# Altium schematic sheet CPU.SchDoc
size A
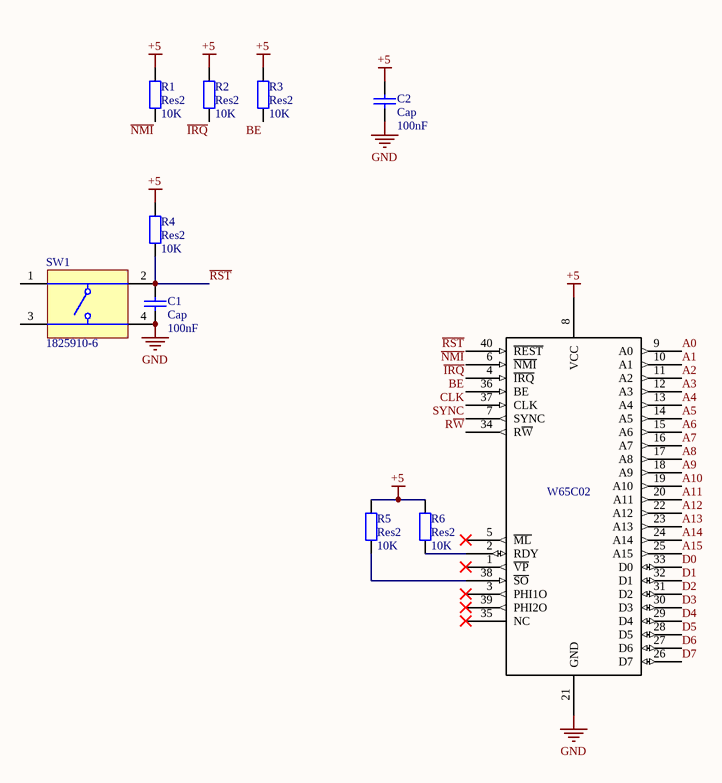
[diagram p0: CPU.SchDoc]

## Parts
?  W65C02  [DIP40]
C1  Cap  value 100nF  [Ceramic Capacitor]
C2  Cap  value 100nF  [Ceramic Capacitor]
R1  Res2  value 10K  [AXIAL-0.4]
R2  Res2  value 10K  [AXIAL-0.4]
R3  Res2  value 10K  [AXIAL-0.4]
R4  Res2  value 10K  [AXIAL-0.4]
R5  Res2  value 10K  [AXIAL-0.4]
R6  Res2  value 10K  [AXIAL-0.4]
SW1  1825910-6  [TECO-1825910-6_V]

## Nets
+5: ?.8(VCC) C2.1 R1.2 R2.2 R3.2 R4.2 R5.2 R6.2
GND: ?.21(GND) C1.2 C2.2 SW1.4
A0: ?.9(A0)
A1: ?.10(A1)
A2: ?.11(A2)
A3: ?.12(A3)
A4: ?.13(A4)
A5: ?.14(A5)
A6: ?.15(A6)
A7: ?.16(A7)
A8: ?.17(A8)
A9: ?.18(A9)
A10: ?.19(A10)
A11: ?.20(A11)
A12: ?.22(A12)
A13: ?.23(A13)
A14: ?.24(A14)
A15: ?.25(A15)
BE: ?.36(BE) R3.1
CLK: ?.37(CLK)
D0: ?.33(D0)
D1: ?.32(D1)
D2: ?.31(D2)
D3: ?.30(D3)
D4: ?.29(D4)
D5: ?.28(D5)
D6: ?.27(D6)
D7: ?.26(D7)
~{IRQ}: ?.4(~{IRQ}) R2.1
~{NMI}: ?.6(~{NMI}) R1.1
~{RST}: ?.40(~{REST}) C1.1 R4.1 SW1.2
R~{W}: ?.34(R~{W})
SYNC: ?.7(SYNC)
Net?_2: ?.2(RDY) R6.1
Net?_38: ?.38(~{SO}) R5.1

Not connected (* = marked no-connect by the designer): ? 1(~{VP})* 3(PHI1O)* 5(~{ML})* 35(NC)* 39(PHI2O)*; SW1 1 3

## Library data of the parts
C1 C2 = Cap: Capacitor; Published: 8-Jun-2000; LatestRevisionDate: 17-Jul-2002; LatestRevisionNote: Re-released for DXP Platform.; PackageReference: RAD-0.3; Publisher: Altium Limited; PackageDescription: Radial Cap, Thru-Hole; 2 Leads; 0.3 in Pin Spacing
R1-R6 = Res2: Resistor; Published: 8-Jun-2000; LatestRevisionDate: 17-Jul-2002; LatestRevisionNote: Re-released for DXP Platform.; PackageReference: AXIAL-0.4; Publisher: Altium Limited; PackageDescription: Axial Device, Thru-Hole; 2 Leads; 0.4 in Pin Spacing
SW1 = CMP-1684-00021-1: Tact Switch, SPST-NO, 0.05 A, -35 to 85 degC, 4-Pin THD, RoHS, Bulk; Manufacturer: TE Connectivity; Maximum Contact Resistance: 100mOhm; Mechanical Life: 100000Cycles; Bushing Type: Unthreaded; Switch Configuration: OFF(ON); Maximum DC Voltage Rating: 24V; Contact Rating @ Voltage: 0.05A@24VDC; Actuator Color: Black; Body Orientation: Straight; Function: MomentaryContact; Illumination: N/R; Actuator Style: RoundButton; Actuator Material: PolybutyleneTerephthalate; Dielectric Strength: 500VAC; Pole Throw Configuration: SPST; Actuator Length: 1.4mm; Product Weight: N/A; Contact Material: CopperAlloy; Housing Material: N/A; Terminal Type: PCPins; Minimum Insulation Resistance: 100MOhm; Package Description: 4-Pin Through Hole Device, Body 5.99 x 5.99 mm, Pitch 6.5 mm; Part No: 1825910-6; Package Reference: THD; Base Material: N/A; Manufacturer URL: http://www.te.com; Contact Plating: Silver; RoHS: Yes; Datasheet Version: Rev. C9; Electrical Life: 100000Cycles; Maximum AC Voltage Rating: N/A; Thread Size: N/R; Operating Temperature: -35to85C; Mounting: ThroughHole; Dimension: 5.99x5mm; Datasheet URL: http://www.te.com/commerce/DocumentDelivery/DDEController?Action=showdoc&DocId=Customer+Drawing%7F1825910%7FC9%7Fpdf%7FEnglish%7FENG_CD_1825910_C9.pdf%7F1825910-6; Family: 1825910; Seal Location: N/A; Seal Description: N/A; Packaging: N/A